# EAGLE design Fonte (EAGLE 9.6.2)
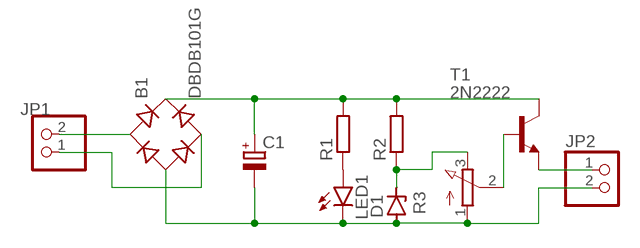
[diagram p0: schematic, sheet 1]

## Parts
B1  DBDB101G  [DB]
C1  CPOL-EUE5-10.5  [E5-10,5]
D1  ZENER-DIODEDO41Z10  [DO41Z10]
JP1  PINHD-1X2  [1X02]
JP2  PINHD-1X2  [1X02]
LED1  LED5MM  [LED5MM]
R1  R-EU_0207/10  [0207/10]
R2  R-EU_0207/10  [0207/10]
R3  3RP/1610N  [3RP/1610N]
T1  2N2222  [TO18]

## Nets
N$1: B1.AC1 JP1.2
N$2: LED1.A R1.1
N$3: B1.AC2 JP1.1
N$4: B1.+ C1.+ R1.2 R2.2 T1.3(C)
N$5: B1.- C1.- D1.A JP2.2 LED1.K(C) R3.1(A)
N$6: D1.C R2.1 R3.3(E)
N$7: R3.2(S) T1.2(B)
N$8: JP2.1 T1.1(E)

## Library data of the parts
B1 = rectifier:DB?*G: Single Phase 1.0 AMP Glass Passivated Bridge Rectifier Taiwan Semiconductor Co.,Ltd. - TSC Source: http://www.taiwansemi.com/TSCbig5/ezcatfiles/cust/img/img/db101g.pdf http://www.ts.com.tw/db/pictures/modules/PDT/PDT060207001/DBLS201G.pdf
C1 = rcl:CPOL-EU: POLARIZED CAPACITOR, European symbol; SPICEPREFIX: C
D1 = diode:ZENER-DIODE: Z-Diode
JP1 = pinhead:PINHD-1X2: PIN HEADER
JP2 = pinhead:PINHD-1X2: PIN HEADER; SPICEPREFIX: B
LED1 = led:LED: LED OSRAM: - CHIPLED LG R971, LG N971, LY N971, LG Q971, LY Q971, LO R971, LY R971 LH N974, LH R974 LS Q976, LO Q976, LY Q976 LO Q996 - Hyper CHIPLED LW Q18S LB Q993, LB Q99A, LB R99A - SideLED LS A670, LO A670, LY A670, LG A670, LP A670 LB A673, LV A673, LT A673, LW A673 LH A674 LY A675 LS A676, LA A676, LO A676, LY A676, LW A676 LS A679, LY A679, LG A679 - Hyper Micro SIDELED® LS Y876, LA Y876, LO Y876, LY Y876 LT Y87S - SmartLED LW L88C, LW L88S LB L89C, LB L89S, LG L890 LS L89K, LO L89K, LY L89K LS L896, LA L896, LO L896, LY L896 - TOPLED LS T670, LO T670, LY T670, LG T670, LP T670 LSG T670, LSP T670, LSY T670, LOP T670, LYG T670 LG T671, LOG T671, LSG T671 LB T673, LV T673, LT T673, LW T673 LH T674 LS T676, LA T676, LO T676, LY T676, LB T676, LH T676, LSB T676, LW T676 LB T67C, LV T67C, LT T67C, LS T67K, LO T67K, LY T67K, LW E67C LS E67B, LA E67B, LO E67B, LY E67B, LB E67C, LV E67C, LT E67C LW T67C LS T679, LY T679, LG T679 LS T770, LO T770, LY T770, LG T770, LP T770 LB T773, LV T773, LT T773, LW T773 LH T774 LS E675, LA E675, LY E675, LS T675 LS T776, LA T776, LO T776, LY T776, LB T776 LHGB T686 LT T68C, LB T68C - Hyper Mini TOPLED® LB M676 - Mini TOPLED Santana® LG M470 LS M47K, LO M47K, LY M47K Source: http://www.osram.convergy.de LUXEON: - LUMILED® LXK2-PW12-R00, LXK2-PW12-S00, LXK2-PW14-U00, LXK2-PW14-V00 LXK2-PM12-R00, LXK2-PM12-S00, LXK2-PM14-U00 LXK2-PE12-Q00, LXK2-PE12-R00, LXK2-PE12-S00, LXK2-PE14-T00, LXK2-PE14-U00 LXK2-PB12-K00, LXK2-PB12-L00, LXK2-PB12-M00, LXK2-PB14-N00, LXK2-PB14-P00, LXK2-PB14-Q00 LXK2-PR12-L00, LXK2-PR12-M00, LXK2-PR14-Q00, LXK2-PR14-R00 LXK2-PD12-Q00, LXK2-PD12-R00, LXK2-PD12-S00 LXK2-PH12-R00, LXK2-PH12-S00 LXK2-PL12-P00, LXK2-PL12-Q00, LXK2-PL12-R00 Source: www.luxeon.com KINGBRIGHT: KA-3528ASYC Source: www.kingbright.com
R1 R2 = rcl:R-EU_: RESISTOR, European symbol; SPICEPREFIX: R
R3 = pot:3RP/1610N: 16mm Potentiometer one level Source: http://www.alphapotentiometers.net/html/16mm_pot_2.html
T1 = transistor:2N2222: NPN TRANSISTOR

## Board
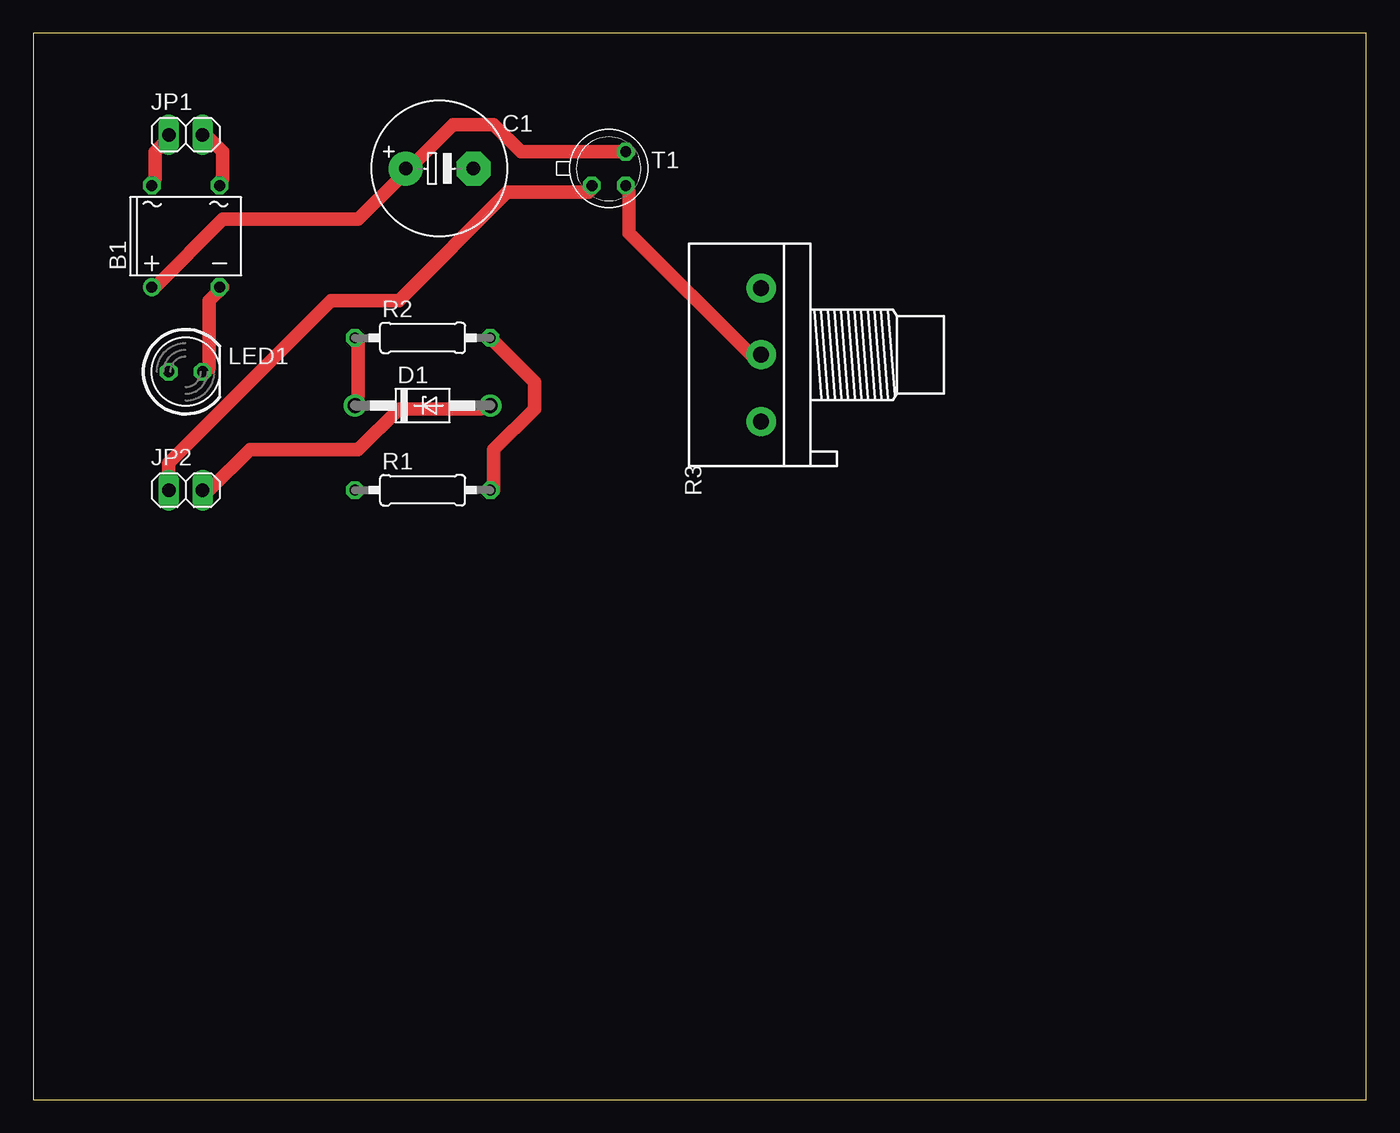
[diagram p1: board, top side]
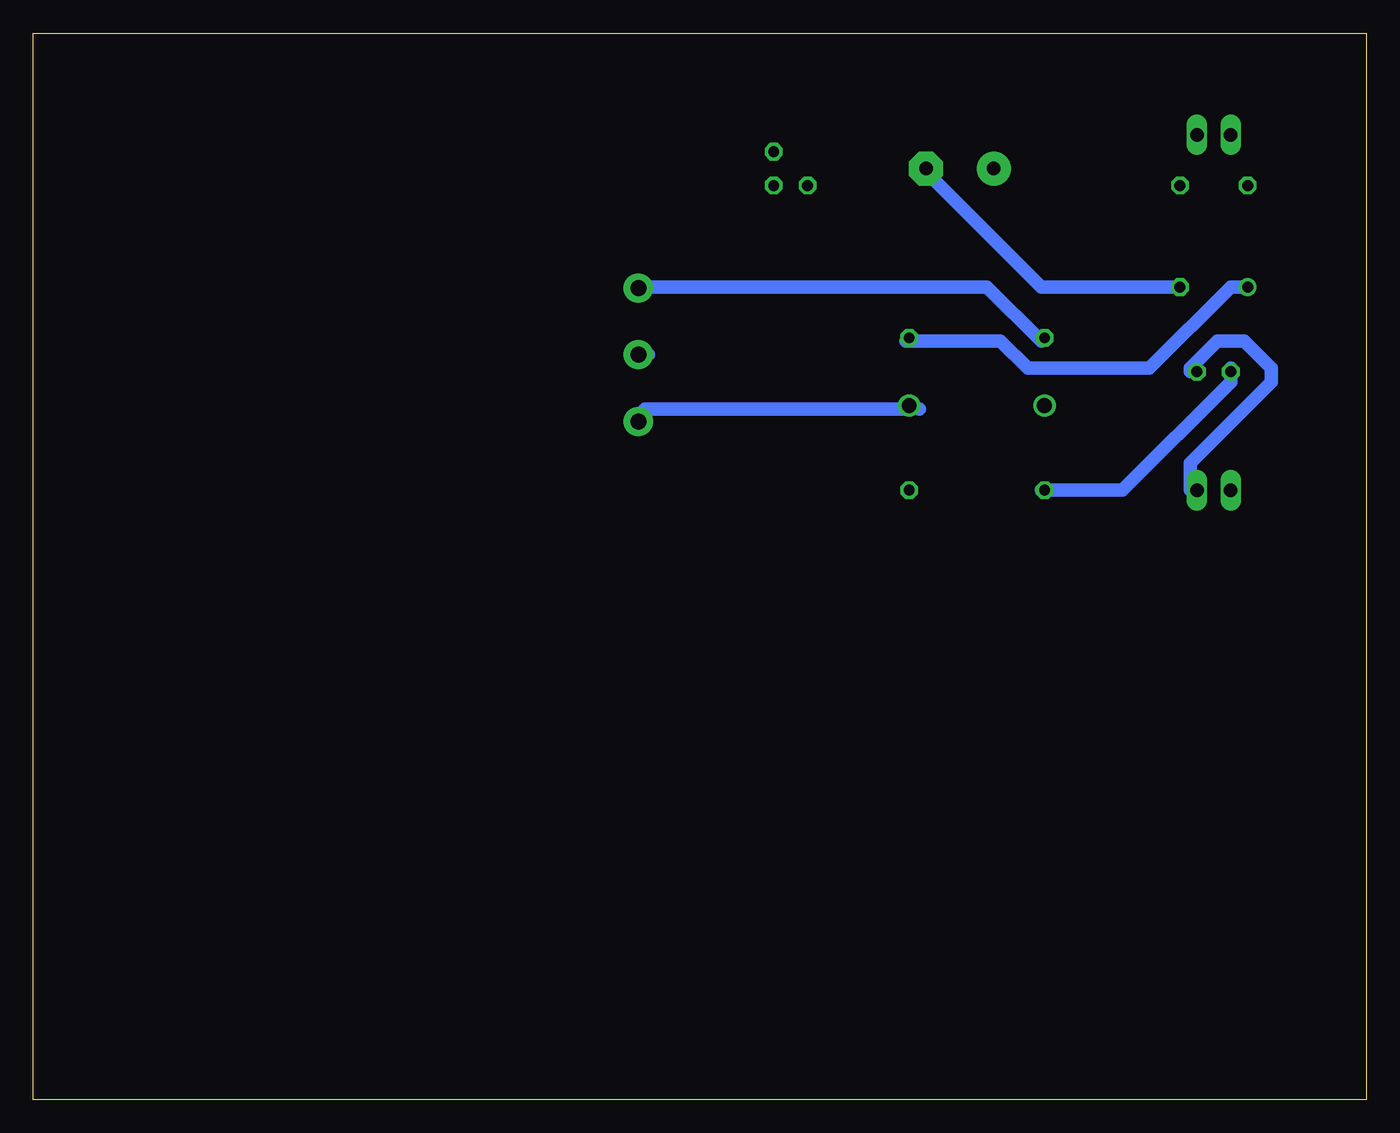
[diagram p2: board, bottom side, seen from below]

Size 100 x 80 mm. Coordinates in mm from the lower left corner, seen from the top.
Outline: 0,0 100,0 100,80 0,80 0,0
Copper layers (1*16): Top 0.035mm / dielectric 1.5mm / Bottom 0.035mm
Design rules "default *": minimum track width 40mil, minimum drill 0.35mm, track to track 40mil, track to pad 40mil, pad to pad 40mil, via to via 40mil, smd to smd 40mil, copper to edge 40mil, drill to drill 6mil, minimum pad ring 10mil, minimum via ring 8mil, stop-mask expansion 4mil, vias tented up to drill 0mil, thermal gap 10mil

### Footprints (pad centres in the part's own frame; a part is rotated, then mirrored left to right if it is on the bottom)
DB = drill 0.813: + -2.54,-3.81 | drill 0.813 octagon: - 2.54,-3.81; AC1 2.54,3.81; AC2 -2.54,3.81
E5-10,5 = drill 1.016 pad 2.54: + -2.54,0 | drill 1.016 pad 2.54 octagon: - 2.54,0
DO41Z10 = drill 1.118: A 5.08,0; C -5.08,0
1X02 = drill 1.016 long: 1 -1.27,0; 2 1.27,0
LED5MM = drill 0.813 octagon: A -1.27,0; K 1.27,0
0207/10 = drill 0.813 octagon: 1 -5.08,0; 2 5.08,0
3RP/1610N = drill 1.2 pad 2.184: 1 -5,0; 2 0,0; 3 5,0
TO18 = drill 0.813 octagon: 1 -1.27,-1.27; 2 1.27,-1.27; 3 1.27,1.27

### Placement (x,y rotation side)
B1  11.43,64.77 0 top
C1  30.48,69.85 0 top
D1  29.21,52.07 0 top
JP1  11.43,72.39 0 top
JP2  11.43,45.72 0 top
LED1  11.43,54.61 0 top
R1  29.21,45.72 0 top
R2  29.21,57.15 0 top
R3  54.61,55.88 90 top
T1  43.18,69.85 0 top

### Tracks (layer width: path | path; a pad name or v marks a point on that pad's centre or on a via)
N$1
  Top 1.016: B1.AC1 14.22,69.09 14.22,71.12 13.21,72.14 JP1.2
N$2
  Bottom 1.016: 24.38,45.72 R1.1 18.29,45.72 10.16,53.85 LED1.A 10.16,54.86
N$3
  Top 1.016: B1.AC2 9.14,69.09 9.14,71.12 10.16,72.14 JP1.1
N$4
  Top 1.016: R2.2 37.59,53.85 37.59,51.82 34.54,48.77 34.54,45.72 R1.2 | B1.+ 9.14,60.96 14.22,66.04 24.38,66.04 27.43,69.09 C1.+ 28.45,70.1 31.5,73.15 34.54,73.15 36.58,71.12 T1.3 44.7,71.12
  Bottom 1.016: 28.45,69.34 C1.+ | R2.2 34.54,56.9 27.43,56.9 25.4,54.86 16.26,54.86 10.16,60.96 9.14,60.96 B1.+
N$5
  Top 1.016: LED1.K 13.21,54.86 13.21,59.94 14.22,60.96 B1.- | D1.A 33.53,51.82 27.43,51.82 24.38,48.77 16.26,48.77 13.21,45.72 JP2.2
  Bottom 1.016: 13.21,54.61 LED1.K 13.21,54.86 11.18,56.9 9.14,56.9 7.11,54.86 7.11,53.85 13.21,47.75 13.21,45.72 JP2.2 13.21,45.97 | R3.1 54.1,51.82 34.54,51.82 D1.A 33.53,51.82 | 33.53,69.34 C1.- 32.51,69.09 24.38,60.96 B1.-
N$6
  Top 1.016: 54.1,60.96 R3.3 | R2.1 24.38,56.9 24.38,52.83 D1.C
  Bottom 1.016: R3.3 53.85,60.96 28.45,60.96 24.38,56.9 R2.1
N$7
  Top 1.016: T1.2 44.7,68.07 44.7,65.02 53.85,55.88 R3.2
  Bottom 1.016: 53.85,55.88 R3.2
N$8
  Top 1.016: JP2.1 10.16,47.75 22.35,59.94 27.43,59.94 35.56,68.07 41.66,68.07 T1.1